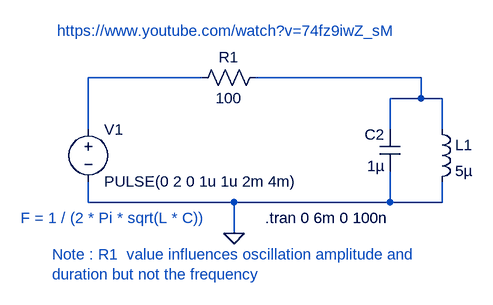
[diagram p0: schematic Mesure1.asc]
Mesure1.asc, the LTspice schematic file:
Version 4
SHEET 1 1020 680
WIRE 160 48 -16 48
WIRE 496 48 240 48
WIRE 496 80 496 48
WIRE 496 80 448 80
WIRE 528 80 496 80
WIRE -16 128 -16 48
WIRE 448 128 448 80
WIRE 528 128 528 80
WIRE -16 240 -16 208
WIRE 208 240 -16 240
WIRE 448 240 448 192
WIRE 448 240 208 240
WIRE 528 240 528 208
WIRE 528 240 448 240
WIRE 208 288 208 240
FLAG 208 288 0
SYMBOL voltage -16 112 R0
WINDOW 123 0 0 Left 0
WINDOW 39 0 0 Left 0
SYMATTR InstName V1
SYMATTR Value PULSE(0 2 0 1u 1u 2m 4m)
SYMBOL cap 464 192 R180
WINDOW 0 24 56 Left 2
WINDOW 3 24 8 Left 2
SYMATTR InstName C2
SYMATTR Value 1µ
SYMBOL ind 512 112 R0
SYMATTR InstName L1
SYMATTR Value 5µ
SYMBOL res 256 32 R90
WINDOW 0 0 56 VBottom 2
WINDOW 3 32 56 VTop 2
SYMATTR InstName R1
SYMATTR Value 100
TEXT 256 264 Left 2 !.tran 0 6m 0 100n
TEXT -120 264 Left 2 ;F = 1 / (2 * Pi * sqrt(L * C))
TEXT -64 -24 Left 2 ;https://www.youtube.com/watch?v=74fz9iwZ_sM
TEXT -72 320 Left 2 ;Note : R1  value influences oscillation amplitude and\nduration but not the frequency

The netlist it stands for:
* Mesure1.asc
V1 N001 0 PULSE(0 2 0 1u 1u 2m 4m)
C2 0 N002 1µ
L1 N002 0 5µ
R1 N002 N001 100
.tran 0 6m 0 100n
* F = 1 / (2 * Pi * sqrt(L * C))
* https://www.youtube.com/watch?v=74fz9iwZ_sM
* Note : R1  value influences oscillation amplitude and
* duration but not the frequency
.backanno
.end